# Altium schematic sheet NB3000_CHC_Graphics.SchDoc
size A4
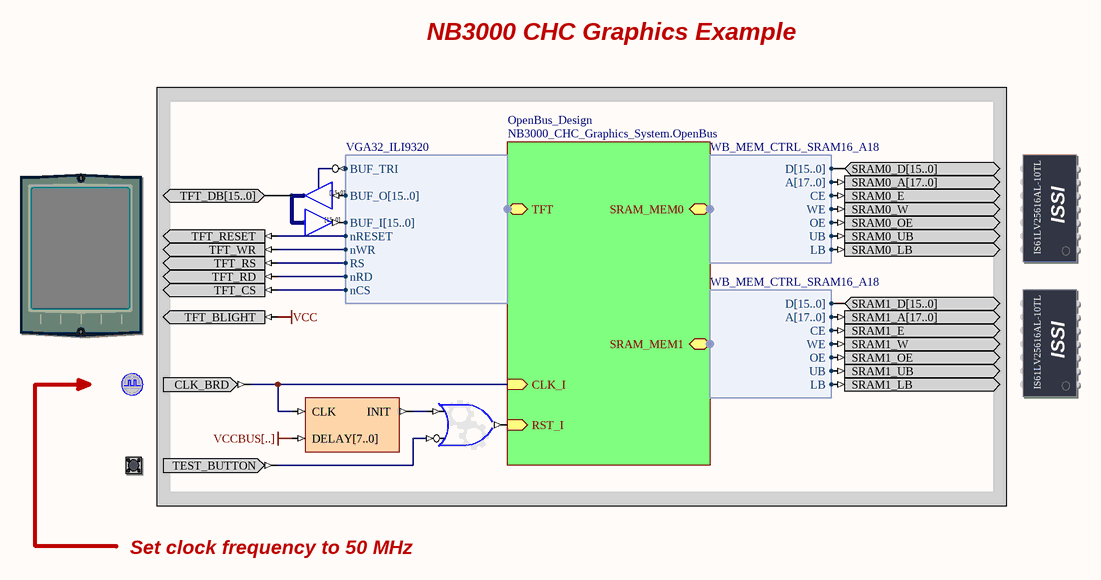
[diagram p0: NB3000_CHC_Graphics.SchDoc]

## Parts
(Parts that share a designator on the sheet are numbered #1, #2 ... from top to bottom, then left to right.)
?#1  SRAM0  (value not drawn)
?#2  TFT_LCD  (value not drawn)
?#3  SRAM1  (value not drawn)
?#4  CLOCK_BOARD  (value not drawn)
?#5  TEST_BUTTON  (value not drawn)
STARTUP_DELAY1  FPGA_STARTUP8  (value not drawn)
STARTUP_OR_RESET  OR2S  (value not drawn)
TFT_IOBUF  IOBUF16B  (value not drawn)

## Sub-sheets
OpenBus_Design = NB3000_CHC_Graphics_System.OpenBus: RST_I (in), CLK_I (in), SRAM_MEM0 (harness WB_MEM_CTRL_SRAM16_A18), SRAM_MEM1 (harness WB_MEM_CTRL_SRAM16_A18), TFT (harness VGA32_ILI9320)

## Harnesses
VGA32_ILI9320: BUF_TRI, BUF_O[15..0], BUF_I[15..0], nRESET, nWR, RS, nRD, nCS
WB_MEM_CTRL_SRAM16_A18: D[15..0], A[17..0], CE, WE, OE, UB, LB

## Nets
VCC: ?#2.TFT_BLIGHT
VCCBUS[..]: STARTUP_DELAY1.DELAY[7..0]
Net?#1_SRAM0_A[17..0]: ?#1.SRAM0_A[17..0] ; sheet OpenBus_Design/SRAM_MEM0.A[17..0]
Net?#1_SRAM0_D[15..0]: ?#1.SRAM0_D[15..0] ; sheet OpenBus_Design/SRAM_MEM0.D[15..0]
Net?#1_SRAM0_E: ?#1.SRAM0_E ; sheet OpenBus_Design/SRAM_MEM0.CE
Net?#1_SRAM0_LB: ?#1.SRAM0_LB ; sheet OpenBus_Design/SRAM_MEM0.LB
Net?#1_SRAM0_OE: ?#1.SRAM0_OE ; sheet OpenBus_Design/SRAM_MEM0.OE
Net?#1_SRAM0_UB: ?#1.SRAM0_UB ; sheet OpenBus_Design/SRAM_MEM0.UB
Net?#1_SRAM0_W: ?#1.SRAM0_W ; sheet OpenBus_Design/SRAM_MEM0.WE
Net?#2_TFT_CS: ?#2.TFT_CS ; sheet OpenBus_Design/TFT.nCS
Net?#2_TFT_DB[15..0]: ?#2.TFT_DB[15..0] TFT_IOBUF.IO[15..0]
Net?#2_TFT_RD: ?#2.TFT_RD ; sheet OpenBus_Design/TFT.nRD
Net?#2_TFT_RESET: ?#2.TFT_RESET ; sheet OpenBus_Design/TFT.nRESET
Net?#2_TFT_RS: ?#2.TFT_RS ; sheet OpenBus_Design/TFT.RS
Net?#2_TFT_WR: ?#2.TFT_WR ; sheet OpenBus_Design/TFT.nWR
Net?#3_SRAM1_A[17..0]: ?#3.SRAM1_A[17..0] ; sheet OpenBus_Design/SRAM_MEM1.A[17..0]
Net?#3_SRAM1_D[15..0]: ?#3.SRAM1_D[15..0] ; sheet OpenBus_Design/SRAM_MEM1.D[15..0]
Net?#3_SRAM1_E: ?#3.SRAM1_E ; sheet OpenBus_Design/SRAM_MEM1.CE
Net?#3_SRAM1_LB: ?#3.SRAM1_LB ; sheet OpenBus_Design/SRAM_MEM1.LB
Net?#3_SRAM1_OE: ?#3.SRAM1_OE ; sheet OpenBus_Design/SRAM_MEM1.OE
Net?#3_SRAM1_UB: ?#3.SRAM1_UB ; sheet OpenBus_Design/SRAM_MEM1.UB
Net?#3_SRAM1_W: ?#3.SRAM1_W ; sheet OpenBus_Design/SRAM_MEM1.WE
Net?#4_CLK_BRD: ?#4.CLK_BRD STARTUP_DELAY1.CLK ; sheet OpenBus_Design/CLK_I
Net?#5_TEST_BUTTON: ?#5.TEST_BUTTON STARTUP_OR_RESET.I1
NetSTARTUP_DELAY1_INIT: STARTUP_DELAY1.INIT STARTUP_OR_RESET.I0
NetSTARTUP_OR_RESET_O: STARTUP_OR_RESET.O ; sheet OpenBus_Design/RST_I
NetTFT_IOBUF_I[15..0]: TFT_IOBUF.I[15..0] ; sheet OpenBus_Design/TFT.BUF_O[15..0]
NetTFT_IOBUF_O[15..0]: TFT_IOBUF.O[15..0] ; sheet OpenBus_Design/TFT.BUF_I[15..0]
NetTFT_IOBUF_T: TFT_IOBUF.T ; sheet OpenBus_Design/TFT.BUF_TRI

## Notes on the sheet
- NB3000 CHC Graphics Example
- Set clock frequency to 50 MHz
- (in symbol IOBUF16B) [15..0]
- (in symbol SRAM0) ISSI; IS61LV25616AL-10TL
- (in symbol SRAM1) ISSI; IS61LV25616AL-10TL

## Library data of the parts
?#1 = SRAM0: Free Static RAM - Daughterboard; PortComponent: True; Published: 14-May-2007; Publisher: Altium Limited; HelpURL: https://wiki.altium.com/display/ADOH/NanoBoard+3000+-+Independent+SRAM
?#2 = TFT_LCD: TFT LCD Panel; PortComponent: True; Published: 22-Jan-2007; Publisher: Altium Limited; HelpURL: https://wiki.altium.com/display/ADOH/NanoBoard+3000+-+TFT+LCD+Panel+%28with+Touch+Screen%29
?#3 = SRAM1: Free Static RAM - Daughterboard; PortComponent: True; Published: 14-May-2007; Publisher: Altium Limited; HelpURL: https://wiki.altium.com/display/ADOH/NanoBoard+3000+-+Independent+SRAM
?#4 = CLOCK_BOARD: Global System Clock Supply; PortComponent: True; Published: 19-Nov-2003; Publisher: Altium Limited; HelpURL: https://wiki.altium.com/display/ADOH/NanoBoard+3000+-+System+Clocks; UseInDSF: True
?#5 = TEST_BUTTON: Test / Reset Button; PortComponent: True; Published: 19-Nov-2003; Publisher: Altium Limited; HelpURL: https://wiki.altium.com/display/ADOH/NanoBoard+3000+-+Test-Reset+Button
STARTUP_DELAY1 = FPGA_STARTUP8: FPGA Startup With 8 Bit Delay; Published: 9-Dec-2004; Publisher: Altium Limited; HelpURL: CR0119 FPGA_STARTUPx Powerup Delay Unit.pdf; LastRevisionNo: 1.00.00; ComponentLink1Description: Core &Resource Usage; ComponentLink1URL: CR0139 FPGA Peripheral Resource Usage.pdf#page=11
STARTUP_OR_RESET = GATE: Configurable Generic Gate; ConfiguratorName: GENERIC_GATE; ConfigurationParameters: {}Version[1.1]{}GateKind[OR]{}BusInput[False]{}GateInputType[Bit]{}GateOutputOption[Normal]{}BusWidth[8]{}RegisterOutputs[False]{}NegativeClockEdge[False]{}InputCount[2]{}InputInvert0[False]{}InputInvert1[True]{}; LastRevisionNo: 1.00.00; Published: 3-Sep-2008; Publisher: Altium Limited; HelpURL: https://wiki.altium.com/display/ADOH/Configurable+Generic+Library
TFT_IOBUF = IOBUF16B: 16-Bit Input/Output Buffer, Bus Version; SubClass: IOBUF; Enable: Low; Control: Common Control T; PortSize: 16; ArchiveName: GENERIC; VHDLIB_SIM: GENERIC_LIB; Published: 29-Jan-2004; Publisher: Altium Limited; LastRevisionNo: 1.00.00; HelpURL: CR0118 FPGA Generic Library Guide.pdf#page=293; ComponentLink1URL: CR0125 FPGA Buffer Resource Usage.pdf#page=91; ComponentLink1Description: Core &Resource Usage; FunctionalClass: Buffer; PortStyle: Bus Version